# EAGLE schematic LED RGB Driver Controler (EAGLE 8.3.2)
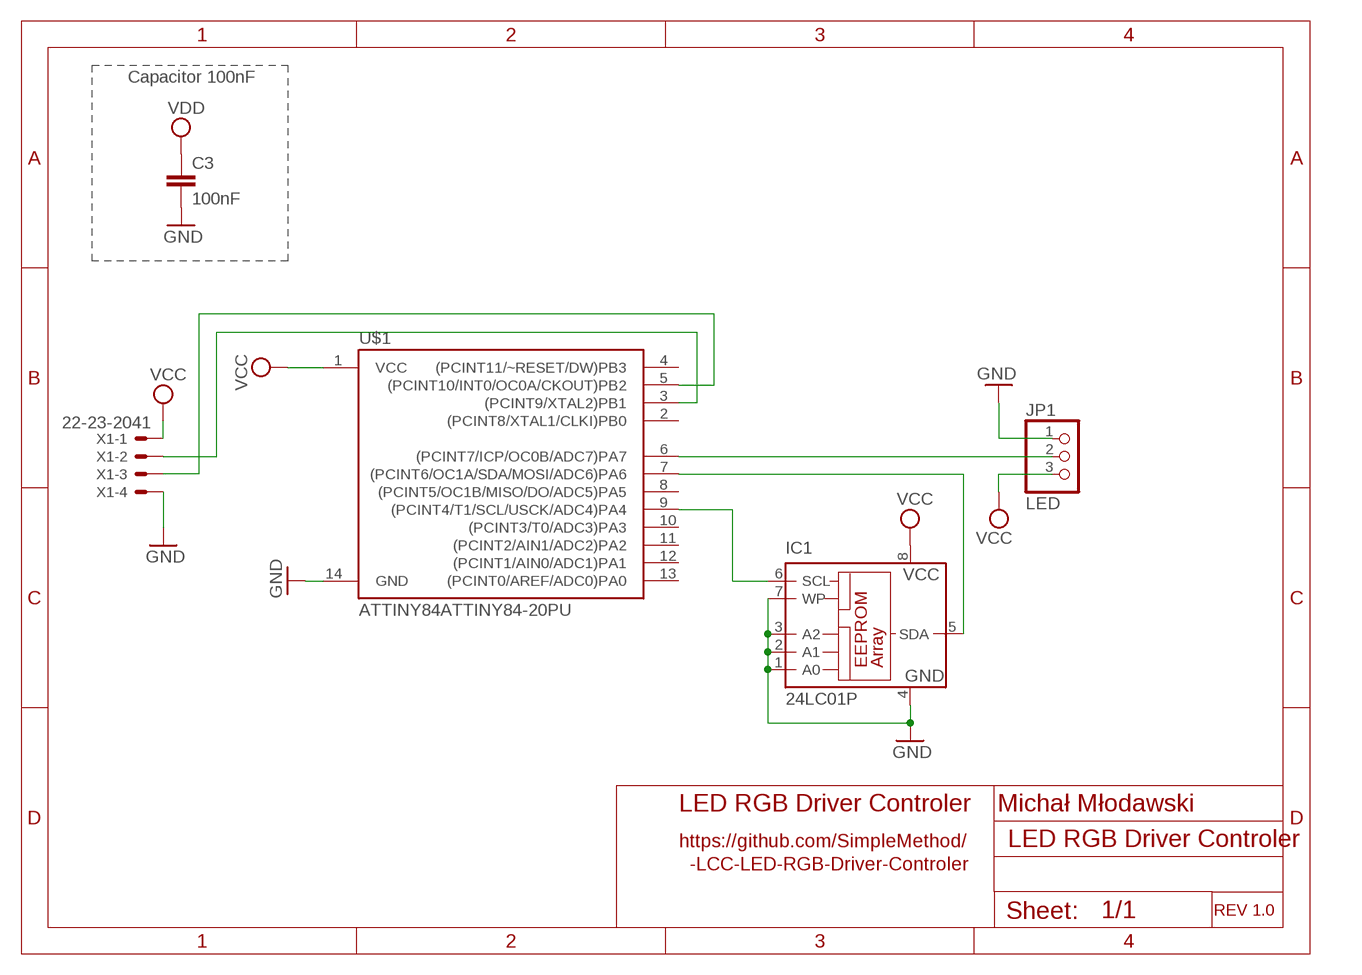
[diagram p0: schematic, sheet 1]

## Parts
C3  100nF  C2,5-3  [C2.5-3]
IC1  24LC01P  [DIL8]
JP1  LED  PINHD-1X3  [1X03]
U$1  ATTINY84ATTINY84-20PU  [DIP14]
X1  22-23-2041  [22-23-2041]

## Nets
GND: C3.2 IC1.1(A0) IC1.2(A1) IC1.3(A2) IC1.7(WP) JP1.1 U$1.14(GND) X1.4
N$1: IC1.6(SCL) U$1.9((PCINT4/T1/SCL/USCK/ADC4)PA4)
N$2: IC1.5(SDA) U$1.7((PCINT6/OC1A/SDA/MOSI/ADC6)PA6)
N$3: JP1.2 U$1.6((PCINT7/ICP/OC0B/ADC7)PA7)
N$4: U$1.5((PCINT10/INT0/OC0A/CKOUT)PB2) X1.3
N$5: U$1.3((PCINT9/XTAL2)PB1) X1.2
VCC: IC1.8(VCC) JP1.3 U$1.1(VCC) X1.1
VDD: C3.1
Unconnected: U$1.2((PCINT8/XTAL1/CLKI)PB0) U$1.4((PCINT11/~RESET/DW)PB3) U$1.8((PCINT5/OC1B/MISO/DO/ADC5)PA5) U$1.10((PCINT3/T0/ADC3)PA3) U$1.11((PCINT2/AIN1/ADC2)PA2) U$1.12((PCINT1/AIN0/ADC1)PA1) U$1.13((PCINT0/AREF/ADC0)PA0)

## Notes on the sheet
- Capacitor 100nF
- Michał Młodawski
- LED RGB Driver Controler
- https://github.com/SimpleMethod/
- -LCC-LED-RGB-Driver-Controler
- REV 1.0

## Power pins joined to a net without a drawn wire
GND: IC1.4(GND)

## Library data of the parts
C3 = capacitor-wima:C: CAPACITOR naming: grid - package width
IC1 = microchip:24*: Serial EEPROM I2C; MPN: 24LC01BH-I/P; OC_FARNELL: 1200025; OC_NEWARK: 77M3542
JP1 = adafruit:PINHD-1X3: PIN HEADER
U$1 = SparkFun-IC-Microcontroller:ATTINY84: Atmel 14-pin 2/4/8kB flash uC Datasheet <https://cdn.sparkfun.com/datasheets/Widgets/doc8006.pdf> SparkFun Products Tiny AVR Programmer <https://www.sparkfun.com/products/11801> (PGM-11801) SparkFun Servo Trigger - Continuous Rotation <https://www.sparkfun.com/products/13872> (WIG-13872) SparkFun Servo Trigger <https://www.sparkfun.com/products/13118> (WIG-13118)
X1 = con-molex:22-23-2041: .100" (2.54mm) Center Header - 4 Pin; MF: MOLEX; MPN: 22-23-2041; OC_FARNELL: 1462920; OC_NEWARK: 38C0355